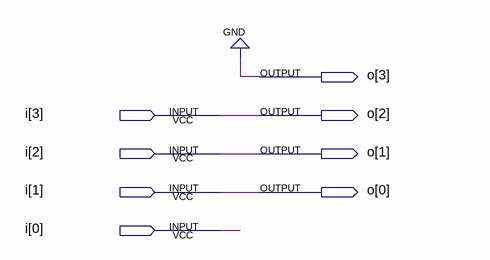
[diagram p0: schematic sheet]
// Quartus schematic div2.bdf as structural Verilog: 0 symbols, 8 pins
module div2 (
  input  [3:0] i,
  output [3:0] o
);


  assign o = {1'b0, i[3:1]};
endmodule
